# Altium schematic sheet 3_mcu.SchDoc
size A4
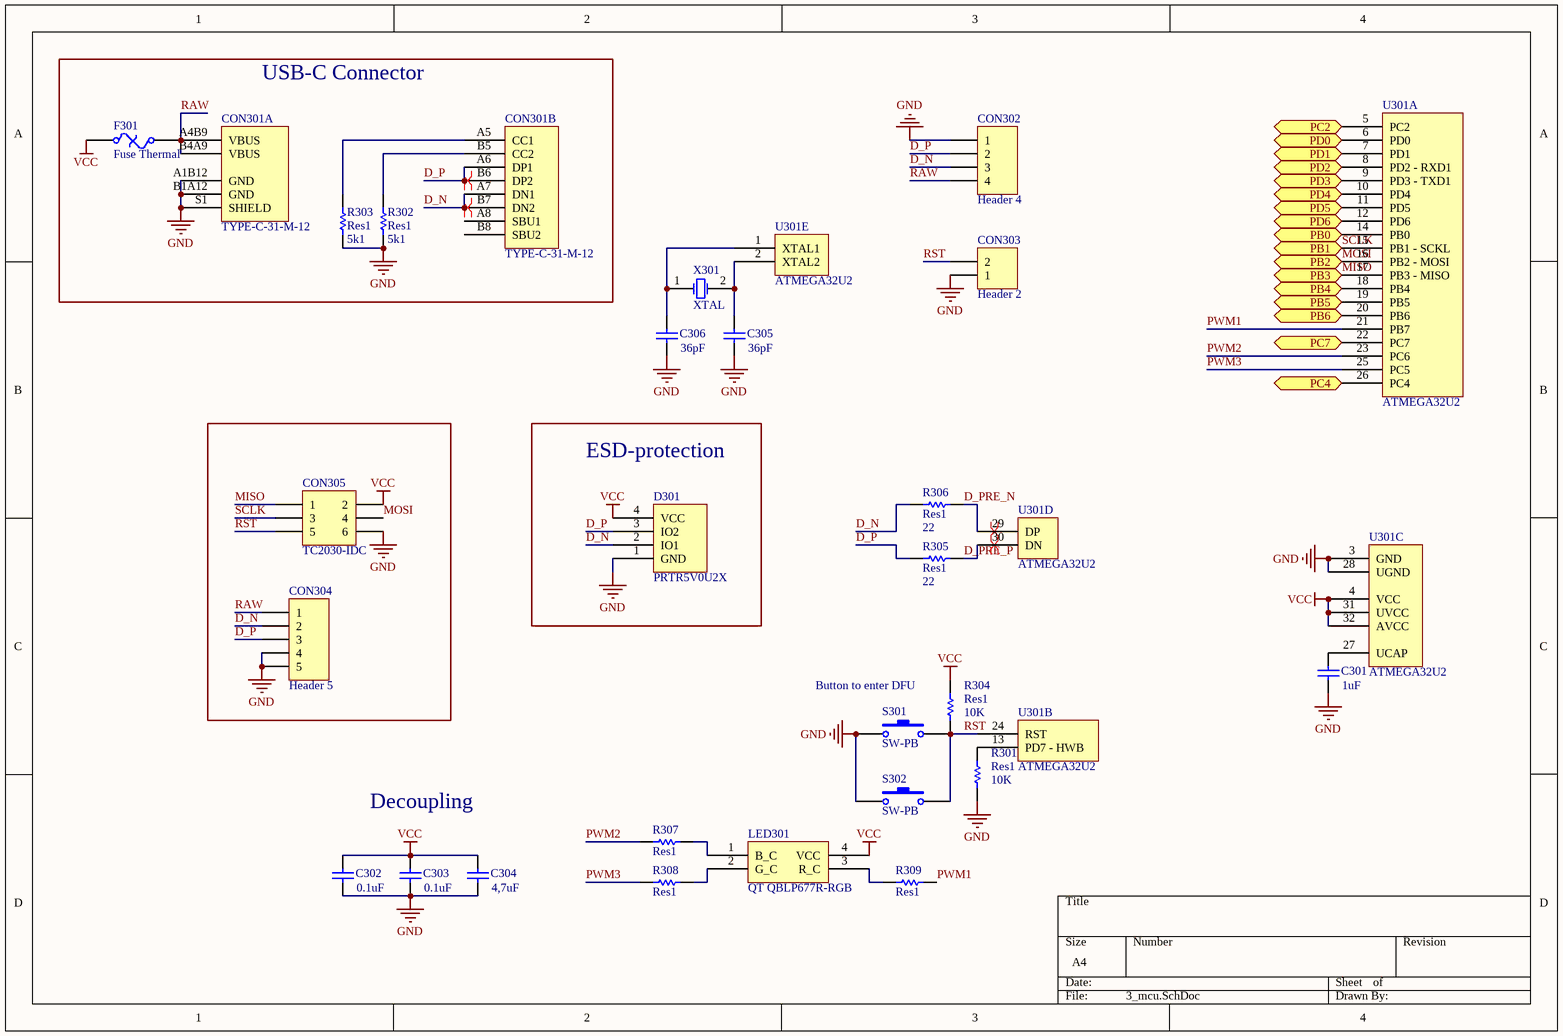
[diagram p0: 3_mcu.SchDoc]

## Parts
C301  value 1uF  [C0603[1608]]
C302  value 0.1uF  [C0603[1608]]
C303  value 0.1uF  [C0603[1608]]
C304  value 4,7uF  [C1206[3216]]
C305  value 36pF  [C0603[1608]]
C306  value 36pF  [C0603[1608]]
CON301  TYPE-C-31-M-12  [TYPE-C-31-M-12]  (parts A,B of 2)
CON302  Header 4  [HDR1X4]  (no BOM)
CON303  Header 2  [HDR1X2]  (no BOM)
CON304  Header 5  [JST SM04B-SRSS-TB]
CON305  TC2030-IDC  [TC2030-IDC-NL]  (no BOM)
D301  PRTR5V0U2X  [SOT190P237X120-4N]
F301  Fuse Thermal  [C1206[3216]]
LED301  QT QBLP677R-RGB  [QT QBLP677R-RGB]
R301  Res1  value 10K  [R0603[1608]]
R302  Res1  value 5k1  [R0603[1608]]
R303  Res1  value 5k1  [R0603[1608]]
R304  Res1  value 10K  [R0603[1608]]
R305  Res1  value 22  [R0603[1608]]
R306  Res1  value 22  [R0603[1608]]
R307  Res1  [R0603[1608]]
R308  Res1  [R0603[1608]]
R309  Res1  [R0603[1608]]
S301  SW-PB  [430152050826]
S302  SW-PB  [430152050826]
U301  ATMEGA32U2  [ATMEGA32U2-COMBO]  (parts A,B,C,D,E of 5)
X301  XTAL  [CTS 445-series crystal]

## Blocks framed on the sheet
USB-C Connector: CON301 F301 R302 R303
ESD-protection: D301

## Ports
PB0, PB1, PB2, PB3, PB4, PB5, PB6, PC2, PC4, PC7, PD0, PD1, PD2, PD3, PD4, PD5, PD6

## Nets
GND: C301.1 C302.1 C303.1 C304.1 C305.1 C306.1 CON301.A1B12(GND) CON301.B1A12(GND) CON301.S1(SHIELD) CON302.1 CON303.1 CON304.4 CON304.5 CON305.6 D301.1(GND) R301.2 R302.2 R303.2 S301.2 S302.1 U301.3(GND) U301.28(UGND)
VCC: C302.2 C303.2 C304.2 CON305.2 D301.4(VCC) F301.1 LED301.4(VCC) R304.1 U301.4(VCC) U301.31(UVCC) U301.32(AVCC)
D_N: CON301.A7(DN1) CON301.B7(DN2) CON302.3 CON304.2 D301.2(IO1) R306.2
D_P: CON301.A6(DP1) CON301.B6(DP2) CON302.2 CON304.3 D301.3(IO2) R305.2
D_PRE_N: R306.1 U301.29(DP)
D_PRE_P: R305.1 U301.30(DN)
MISO: CON305.1 U301.17(PB3_-_MISO) ; port PB3
MOSI: CON305.4 U301.16(PB2_-_MOSI) ; port PB2
PB0: U301.14(PB0) ; port PB0
PB4: U301.18(PB4) ; port PB4
PB5: U301.19(PB5) ; port PB5
PB6: U301.20(PB6) ; port PB6
PC2: U301.5(PC2) ; port PC2
PC4: U301.26(PC4) ; port PC4
PC7: U301.22(PC7) ; port PC7
PD0: U301.6(PD0) ; port PD0
PD1: U301.7(PD1) ; port PD1
PD2: U301.8(PD2_-_RXD1) ; port PD2
PD3: U301.9(PD3_-_TXD1) ; port PD3
PD4: U301.10(PD4) ; port PD4
PD5: U301.11(PD5) ; port PD5
PD6: U301.12(PD6) ; port PD6
PWM1: R309.1 U301.21(PB7)
PWM2: R307.2 U301.23(PC6)
PWM3: R308.2 U301.25(PC5)
RAW: CON301.A4B9(VBUS) CON301.B4A9(VBUS) CON302.4 CON304.1 F301.2
RST: CON303.2 CON305.5 R304.2 S301.1 S302.2 U301.24(RST)
SCLK: CON305.3 U301.15(PB1_-_SCKL) ; port PB1
NetC301_2: C301.2 U301.27(UCAP)
NetC305_2: C305.2 U301.2(XTAL2) X301.2(OSC2)
NetC306_2: C306.2 U301.1(XTAL1) X301.1(OSC1)
NetCON301_A5: CON301.A5(CC1) R303.1
NetCON301_B5: CON301.B5(CC2) R302.1
NetLED301_1: LED301.1(B_C) R307.1
NetLED301_2: LED301.2(G_C) R308.1
NetLED301_3: LED301.3(R_C) R309.2
NetR301_1: R301.1 U301.13(PD7_-_HWB)

Not connected (* = marked no-connect by the designer): CON301 A8(SBU1) B8(SBU2)

## Layout directives
differential pair: D_N, D_P, D_PRE_N, D_PRE_P

## Notes on the sheet
- (near R304) Button to enter DFU
- Decoupling

## Library data of the parts
C301 = Cap: Capacitor; MRF.Part: CL10A105KB8NNNC; MFG: KEMET; MFGPN: C0603C104M5RACTU; LCSC MFG: Samsung Electro-Mechanics; Version: 0603 imperial; LCSCPN: C15849
C302 C303 = Cap: Capacitor; MRF.Part: CC0603KRX7R9BB104; MFG: KEMET; MFGPN: C0603C104M5RACTU; LCSC MFG: YAGEO; Version: 0603 imperial; LCSCPN: C14663
C304 = Cap: Capacitor; MRF.Part: 1206B475K500NT; MFG: KEMET; MFGPN: C0603C104M5RACTU; LCSC MFG: Guangdong Fenghua Advanced Tech; Version: 1206 imperial; LCSCPN: C29823
C305 C306 = Cap: Capacitor; MRF.Part: CL10C360JB8NNNC; MFG: KEMET; MFGPN: C0603C104M5RACTU; LCSC MFG: Samsung Electro-Mechanics; Version: 0603 imperial; LCSCPN: C159790
CON301 = TYPE-C-31-M-12: MFG: Korean Hroparts Elec; MFGPN: TYPE-C-31-M-12; LCSCPN: C165948; LCSC MFG: Korean Hroparts Elec; MRF.Part: TYPE-C-31-M-12
CON302 = Header 4: Header, 4-Pin
CON303 = Header 2: Header, 2-Pin
CON304 = Header 5: Header, 5-Pin; MFGPN: SM04B-SRSS-TB(LF)(SN); MFG: JST Sales America Inc.; LCSC MFG: JST Sales America; LCSCPN: C160404; MRF.Part: SM04B-SRSS-TB(LF)(SN)
CON305 = Header 3X2: Header, 3-Pin, Dual row
D301 = PRTR5V0U2X: MRF.Part: UET14A05L03; MFG: Nexperia USA Inc.; MFGPN: PRTR5V0U2X,215; LCSC MFG: Brightking Elec (TAIWAN); LCSCPN: C78442
F301 = Fuse Thermal: Thermal Fuse; MRF.Part: ASMD1206-050; MFG: Bel Fuse Inc.; MFGPN: 0ZCJ0050FF2G; LCSC MFG: Shenzhen JDT Fuse; LCSCPN: C135338
R301 R304 = Res1: Resistor; MRF.Part: 0603WAF1002T5E; MFG: Panasonic Electronic Components; MFGPN: ERJ-3EKF5101V; LCSC MFG: Uniroyal Elec; Version: 0603 imperial; LCSCPN: C25804
R302 R303 = Res1: Resistor; MRF.Part: 0603WAF5101T5E; MFG: Panasonic Electronic Components; MFGPN: ERJ-3EKF5101V; LCSC MFG: Uniroyal Elec; Version: 0603 imperial; LCSCPN: C23186
R305 R306 = Res1: Resistor; MRF.Part: 0603WAF220JT5E; MFG: Panasonic Electronic Components; MFGPN: ERJ-3EKF5101V; LCSC MFG: Uniroyal Elec; Version: 0603 imperial; LCSCPN: C23345
R307-R309 = Res1: Resistor; Version: 0603 imperial
S301 S302 = SW-PB: Switch; MRF.Part: TS-1187A-C-D-B; MFGPN: PTS645SM43SMTR92 LFS; MFG: C&K; LCSC MFG: XKB Enterprise; LCSCPN: C318888
U301 = ATMEGA32U2: MFG: Microchip Technology; MFGPN: ATMEGA32U2-AUR
X301 = XTAL: Crystal Oscillator; MRF.Part: X503216MSB2GI; LCSC MFG: Yangxing Tech; LCSCPN: C112572